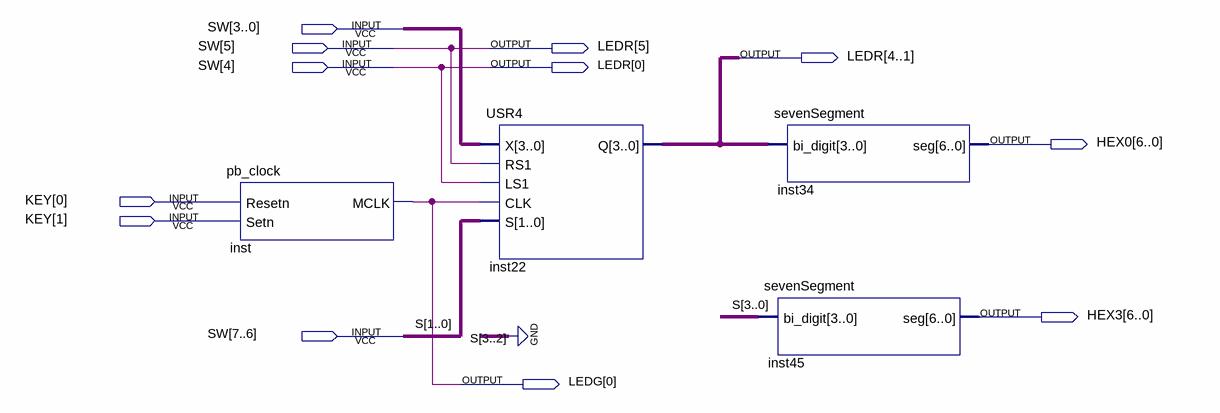
[diagram p0: schematic sheet]
// Quartus schematic Lab8.bdf as structural Verilog: 4 symbols, 12 pins
module Lab8 (
  input  [7:0] SW,
  input  [1:0] KEY,
  output [5:0] LEDR,
  output [6:0] HEX0,
  output [6:0] HEX3,
  output [0:0] LEDG
);

  pb_clock inst (.Resetn(KEY[0]), .Setn(KEY[1]), .MCLK(LEDG[0]));
  USR4 inst22 (.X(SW[3:0]), .RS1(SW[5]), .LS1(SW[4]), .CLK(LEDG[0]), .S(SW[7:6]), .Q(LEDR[4:1]));
  sevenSegment inst45 (.bi_digit({2'b00, SW[7:6]}), .seg(HEX3));
  sevenSegment inst34 (.bi_digit(LEDR[4:1]), .seg(HEX0));

  assign {LEDR[5], LEDR[0]} = SW[5:4];

  // Other names for the same wires on the sheet: S[1:0] = SW[7:6]
endmodule
